# EAGLE design ecg_2017_nano (EAGLE 7.6.0)
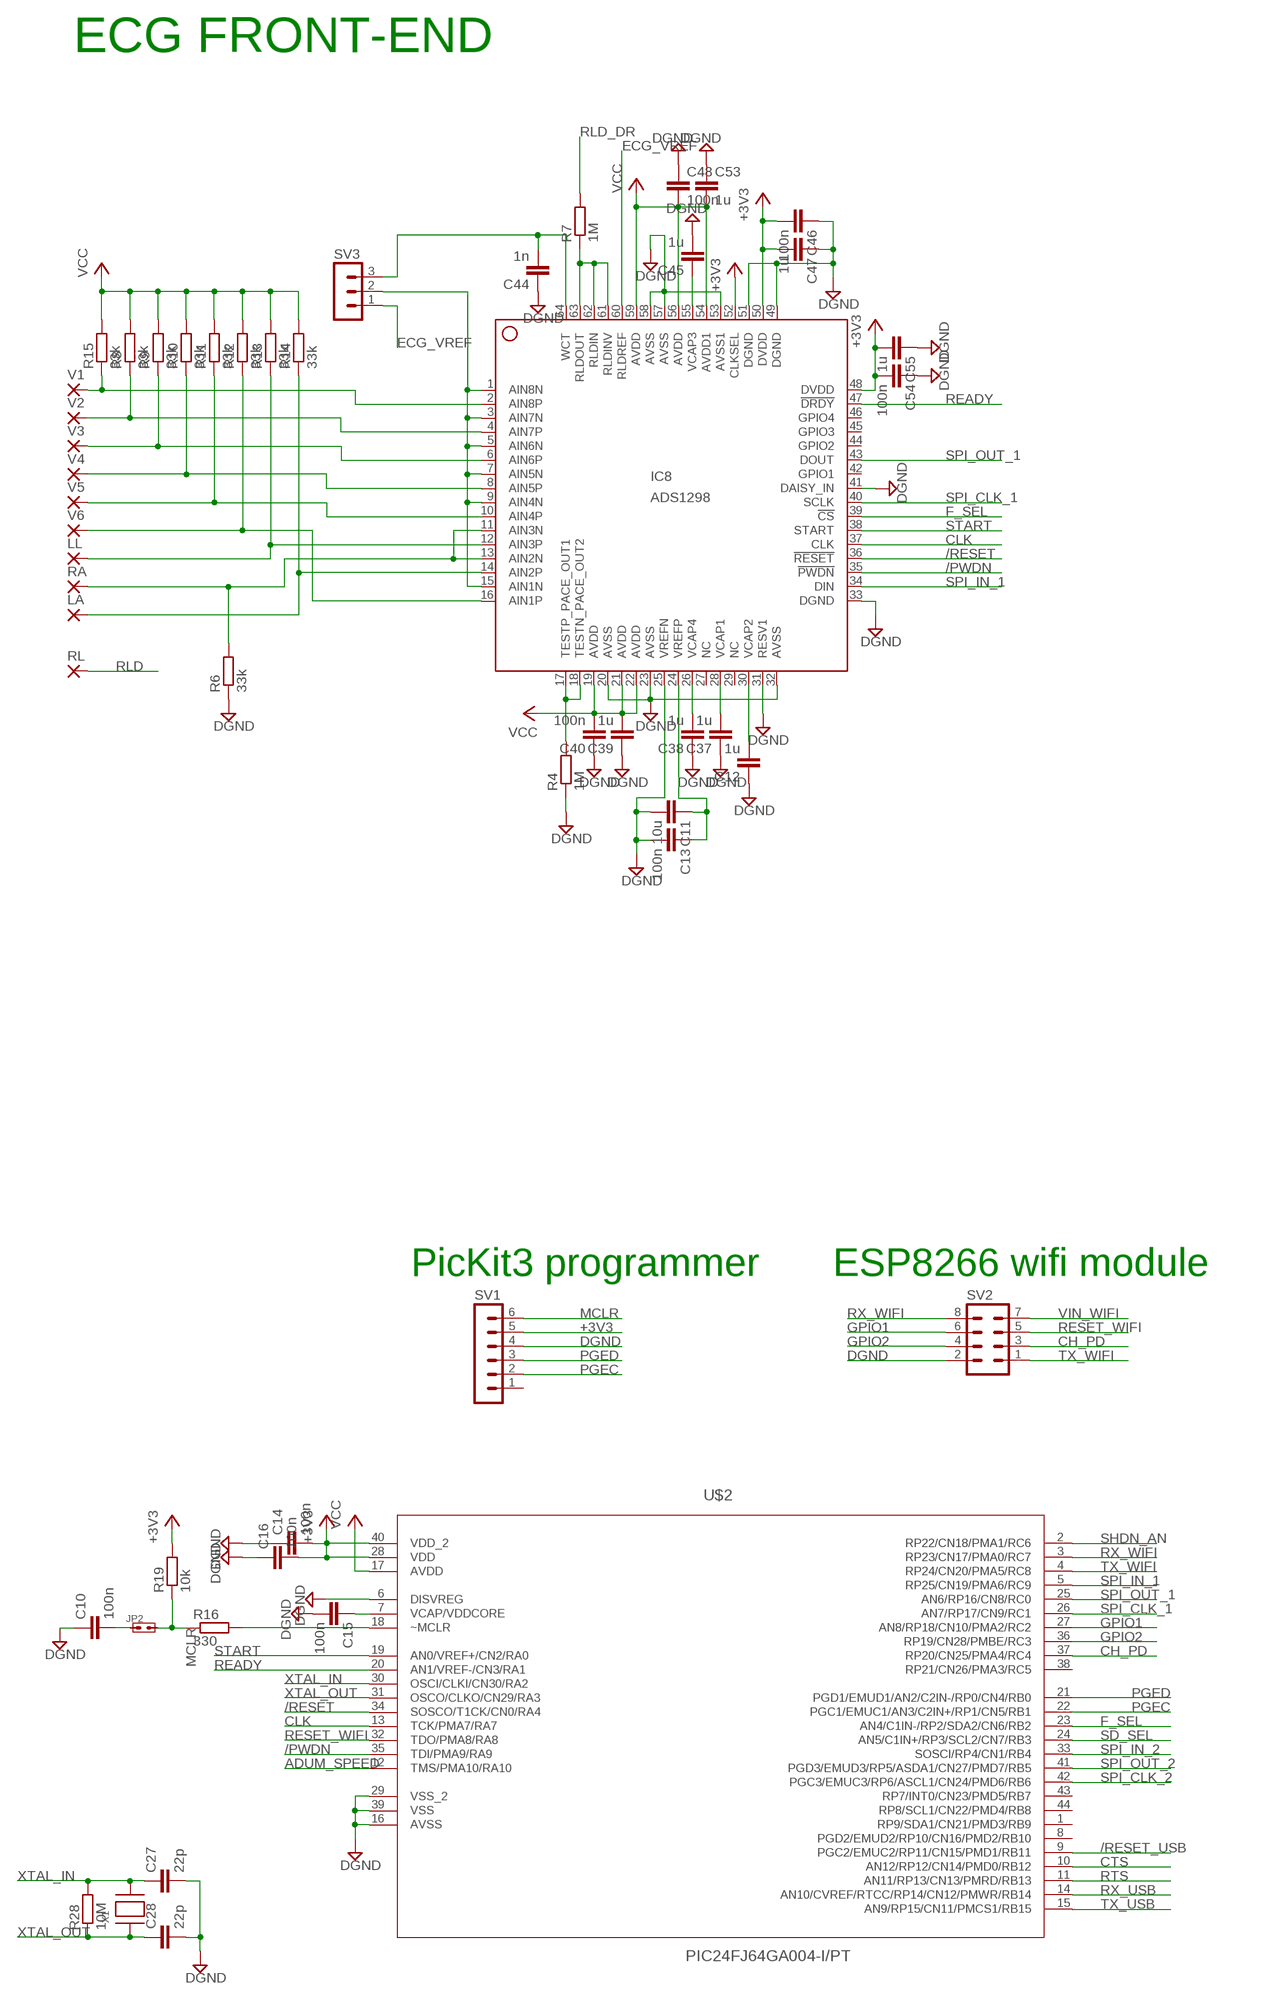
[diagram p0: schematic, sheet 1, part 1 of 2]
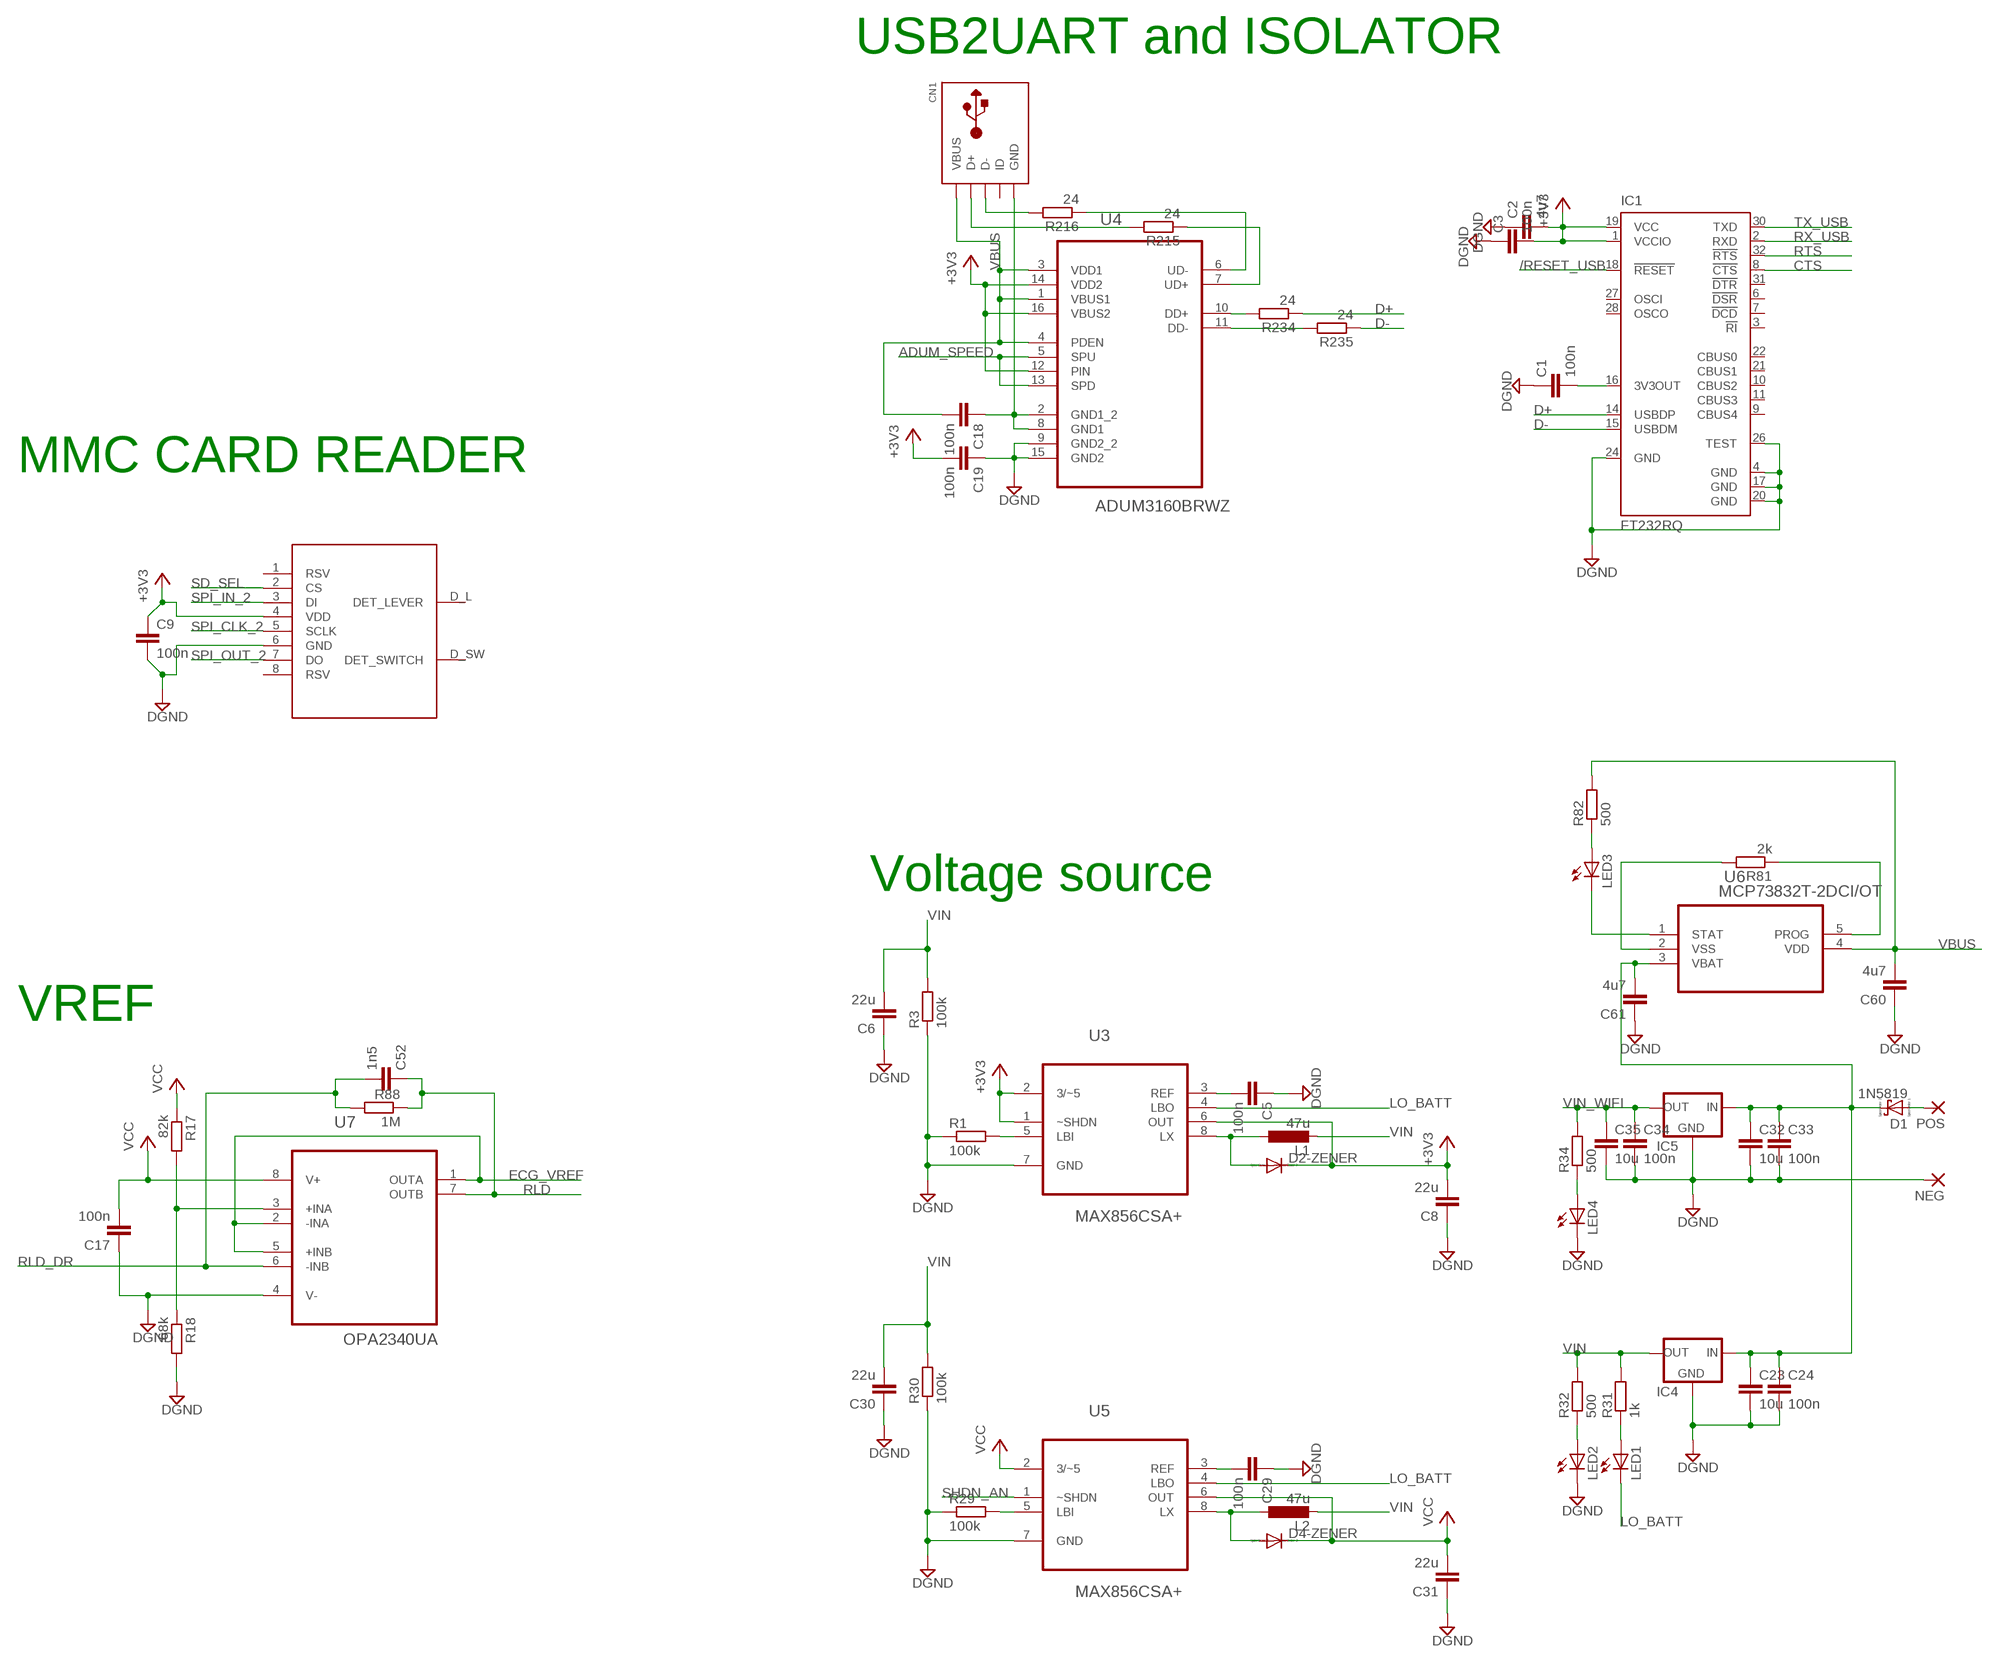
[diagram p1: schematic, sheet 1, part 2 of 2]

## Parts
C1  100n  C-EUC0603  [C0603]
C2  4u7  C-EUC0603  [C0603]
C3  100n  C-EUC0603  [C0603]
C5  100n  C-EUC0805  [C0805]
C6  22u  C-EUC0805  [C0805]
C8  22u  C-EUC0805  [C0805]
C9  100n  C-EUC0603  [C0603]
C10  100n  C-EUC0603  [C0603]
C11  10u  C-EUC0402  [C0402]
C12  1u  C-EUC0402  [C0402]
C13  100n  C-EUC0402  [C0402]
C14  100n  C-EUC0603  [C0603]
C15  100n  C-EUC0603  [C0603]
C16  100n  C-EUC0603  [C0603]
C17  100n  C-EUC0603  [C0603]
C18  100n  C-EUC0603  [C0603]
C19  100n  C-EUC0603  [C0603]
C23  10u  C-EUC0805  [C0805]
C24  100n  C-EUC0805  [C0805]
C27  22p  C-EUC0603  [C0603]
C28  22p  C-EUC0603  [C0603]
C29  100n  C-EUC0805  [C0805]
C30  22u  C-EUC0805  [C0805]
C31  22u  C-EUC0805  [C0805]
C32  10u  C-EUC0805  [C0805]
C33  100n  C-EUC0805  [C0805]
C34  100n  C-EUC0805  [C0805]
C35  10u  C-EUC0805  [C0805]
C37  1u  C-EUC0402  [C0402]
C38  1u  C-EUC0402  [C0402]
C39  1u  C-EUC0402  [C0402]
C40  100n  C-EUC0402  [C0402]
C44  1n  C-EUC0402  [C0402]
C45  1u  C-EUC0402  [C0402]
C46  100n  C-EUC0402  [C0402]
C47  1u  C-EUC0402  [C0402]
C48  100n  C-EUC0402  [C0402]
C52  1n5  C-EUC0603  [C0603]
C53  1u  C-EUC0402  [C0402]
C54  100n  C-EUC0402  [C0402]
C55  1u  C-EUC0402  [C0402]
C60  4u7  C-EUC0805  [C0805]
C61  4u7  C-EUC0805  [C0805]
CN1  USBMINIB  [USB-MINIB]
D1  1N5819  SCHOTTKY-DIODE  [DIODE_SMB]
D2-ZENER  DIODE-MICROMELF-R  [MICROMELF-R]
D4-ZENER  DIODE-MICROMELF-R  [MICROMELF-R]
IC1  FT232RQ  [QFN32]
IC4  R-783.3-0.5  [R-78XX]
IC5  R-783.3-0.5  [R-78XX]
IC8  ADS1298  [HTQFP-64-PAP]
JP2  JMP2  [JP2]
L1  47u  L-EUL2012C  [L2012C]
L2  47u  L-EUL2012C  [L2012C]
LA  2,54/1,0  [2,54/1,0]
LED1  LEDSML0805  [SML0805]
LED2  LEDSML0805  [SML0805]
LED3  LEDSML0805  [SML0805]
LED4  LEDSML0805  [SML0805]
LL  2,54/1,0  [2,54/1,0]
NEG  2,54/1,0  [2,54/1,0]
POS  2,54/1,0  [2,54/1,0]
R1  100k  R0805  [R0805]
R3  100k  R0805  [R0805]
R4  1M  R0603  [R0603]
R6  33k  R0603  [R0603]
R7  1M  R0603  [R0603]
R8  33k  R0603  [R0603]
R9  33k  R0603  [R0603]
R10  33k  R0603  [R0603]
R11  33k  R0603  [R0603]
R12  33k  R0603  [R0603]
R13  33k  R0603  [R0603]
R14  33k  R0603  [R0603]
R15  33k  R0603  [R0603]
R16  330  R0603  [R0603]
R17  82k  R0603  [R0603]
R18  68k  R0603  [R0603]
R19  10k  R0603  [R0603]
R28  10M  R-EU_R0603  [R0603]
R29  100k  R0805  [R0805]
R30  100k  R0805  [R0805]
R31  1k  R0805  [R0805]
R32  500  R0805  [R0805]
R34  500  R0805  [R0805]
R81  2k  R0805  [R0805]
R82  500  R0805  [R0805]
R88  1M  R0603  [R0603]
R215  24  R0603  [R0603]
R216  24  R0603  [R0603]
R234  24  R0603  [R0603]
R235  24  R0603  [R0603]
RA  2,54/1,0  [2,54/1,0]
RL  2,54/1,0  [2,54/1,0]
SV1  MA06-1  [MA06-1]
SV2  MA04-2  [MA04-2]
SV3  MA03-1  [MA03-1]
U3  MAX856CSA+  [SOIC127P600X175-8N]
U4  ADUM3160BRWZ  [SOIC127P1032X265-16N]
U5  MAX856CSA+  [SOIC127P600X175-8N]
U6  MCP73832T-2DCI/OT  [SOT95P300X145-5N]
U7  OPA2340UA  [SOIC127P600X175-8N]
U$1  MICROSDCARD_CONNECTOR  [MICROSDCARD_CONNECTOR]
U$2  PIC24FJ64GA004-I/PT  [QFP80P1200X1200X120-44N]
V1  2,54/1,0  [2,54/1,0]
V2  2,54/1,0  [2,54/1,0]
V3  2,54/1,0  [2,54/1,0]
V4  2,54/1,0  [2,54/1,0]
V5  2,54/1,0  [2,54/1,0]
V6  2,54/1,0  [2,54/1,0]
X1  XTAL-3.2X1.5  [XTAL3215]

## Nets
+3V3: C2.2 C3.2 C8.2 C9.1 C14.2 C16.2 C19.2 C46.2 C47.2 C54.2 C55.2 D2-ZENER.C IC1.1(VCCIO) IC1.19(VCC) IC8.48(DVDD) IC8.50(DVDD) IC8.52(CLKSEL) R19.2 SV1.5 U3.1(~SHDN) U3.2(3/~5) U3.6(OUT) U4.12(PIN) U4.14(VDD2) U4.16(VBUS2) U$1.4(VDD) U$2.28(VDD) U$2.40(VDD_2)
/PWDN: IC8.35(!PWDN) U$2.35(TDI/PMA9/RA9)
/RESET: IC8.36(!RESET) U$2.34(SOSCO/T1CK/CN0/RA4)
/RESET_USB: IC1.18(!RESET) U$2.9(PGC2/EMUC2/RP11/CN15/PMD1/RB11)
ADUM_SPEED: U4.5(SPU) U4.13(SPD) U$2.12(TMS/PMA10/RA10)
CH_PD: SV2.3 U$2.37(RP20/CN25/PMA4/RC4)
CLK: IC8.37(CLK) U$2.13(TCK/PMA7/RA7)
CTS: IC1.8(!CTS) U$2.10(AN12/RP12/CN14/PMD0/RB12)
D+: IC1.14(USBDP) R234.1
D-: IC1.15(USBDM) R235.1
DGND: C1.1 C2.1 C3.1 C5.1 C6.1 C8.1 C9.2 C10.1 C11.2 C12.1 C13.2 C14.1 C15.2 C16.1 C17.1 C19.1 C23.2 C24.2 C27.2 C28.2 C29.1 C30.1 C31.1 C32.2 C33.2 C34.2 C35.2 C37.1 C38.1 C39.1 C40.1 C44.1 C45.2 C46.1 C47.1 C48.1 C53.1 C54.1 C55.1 C60.1 C61.1 IC1.4(GND) IC1.17(GND) IC1.20(GND) IC1.24(GND) IC1.26(TEST) IC4.GND IC5.GND IC8.20(AVSS) IC8.23(AVSS) IC8.25(VREFN) IC8.31(RESV1) IC8.32(AVSS) IC8.33(DGND) IC8.41(DAISY_IN) IC8.49(DGND) IC8.51(DGND) IC8.53(AVSS1) IC8.57(AVSS) IC8.58(AVSS) LED2.C LED4.C NEG.1(P) R1.1 R3.1 R4.1 R6.1 R18.2 R29.1 R30.1 SV1.4 SV2.2 U3.7(GND) U4.9(GND2_2) U4.15(GND2) U5.7(GND) U7.4(V-) U$1.6(GND) U$2.6(DISVREG) U$2.16(AVSS) U$2.29(VSS_2) U$2.39(VSS)
ECG: IC8.1(AIN8N) IC8.3(AIN7N) IC8.5(AIN6N) IC8.7(AIN5N) IC8.9(AIN4N) IC8.15(AIN1N) SV3.2
ECG_VREF: IC8.60(RLDREF) SV3.1 U7.1(OUTA) U7.2(-INA) U7.5(+INB)
F_SEL: IC8.39(!CS) U$2.23(AN4/C1IN-/RP2/SDA2/CN6/RB2)
GPIO1: SV2.6 U$2.27(AN8/RP18/CN10/PMA2/RC2)
GPIO2: SV2.4 U$2.36(RP19/CN28/PMBE/RC3)
LO_BATT: LED1.C U3.4(LBO) U5.4(LBO)
MCLR: JP2.2 R16.1 R19.1 SV1.6
N$1: C5.2 U3.3(REF)
N$2: R1.2 U3.5(LBI)
N$3: IC8.17(TESTP_PACE_OUT1) IC8.18(TESTN_PACE_OUT2) R4.2
N$4: D2-ZENER.A L1.1 U3.8(LX)
N$5: IC8.14(AIN2P) LA.1(P) R14.1
N$6: IC8.16(AIN1P) R12.1 V6.1(P)
N$7: IC8.11(AIN3N) IC8.13(AIN2N) R6.2 RA.1(P)
N$8: C12.2 IC8.30(VCAP2)
N$9: IC8.12(AIN3P) LL.1(P) R13.1
N$10: C1.2 IC1.16(3V3OUT)
N$12: IC8.10(AIN4P) R11.1 V5.1(P)
N$13: D1.A(C) POS.1(P)
N$14: IC8.8(AIN5P) R10.1 V4.1(P)
N$15: C11.1 C13.1 IC8.24(VREFP)
N$16: IC8.6(AIN6P) R9.1 V3.1(P)
N$17: IC8.4(AIN7P) R8.1 V2.1(P)
N$18: R17.2 R18.1 U7.3(+INA)
N$19: IC8.2(AIN8P) R15.1 V1.1(P)
N$20: IC8.61(RLDINV) IC8.62(RLDIN) IC8.63(RLDOUT) R7.1
N$21: C10.2 JP2.1
N$22: C29.2 U5.3(REF)
N$23: R16.2 U$2.18(~MCLR)
N$24: C15.1 U$2.7(VCAP/VDDCORE)
N$25: C23.1 C24.1 C32.1 C33.1 C61.2 D1.C(A) IC4.IN IC5.IN U6.3(VBAT)
N$26: R81.1 U6.5(PROG)
N$27: R81.2 U6.2(VSS)
N$28: LED3.A R82.1
N$29: LED3.C U6.1(STAT)
N$32: C37.2 IC8.28(VCAP1)
N$33: C38.2 IC8.26(VCAP4)
N$38: R29.2 U5.5(LBI)
N$40: D4-ZENER.A L2.1 U5.8(LX)
N$41: LED1.A R31.1
N$42: LED2.A R32.1
N$44: C44.2 IC8.64(WCT) SV3.3
N$45: LED4.A R34.1
N$46: C45.1 IC8.55(VCAP3)
N$102: R216.1 U4.6(UD-)
N$103: R215.1 U4.7(UD+)
N$123: CN1.D- R216.2
N$124: R234.2 U4.10(DD+)
N$140: CN1.D+ R215.2
N$141: R235.2 U4.11(DD-)
PGEC: SV1.2 U$2.22(PGC1/EMUC1/AN3/C2IN+/RP1/CN5/RB1)
PGED: SV1.3 U$2.21(PGD1/EMUD1/AN2/C2IN-/RP0/CN4/RB0)
READY: IC8.47(!DRDY) U$2.20(AN1/VREF-/CN3/RA1)
RESET_WIFI: SV2.5 U$2.32(TDO/PMA8/RA8)
RLD: C52.1 R88.1 RL.1(P) U7.7(OUTB)
RLD_DR: C52.2 R7.2 R88.2 U7.6(-INB)
RTS: IC1.32(!RTS) U$2.11(AN11/RP13/CN13/PMRD/RB13)
RX_USB: IC1.2(RXD) U$2.14(AN10/CVREF/RTCC/RP14/CN12/PMWR/RB14)
RX_WIFI: SV2.8 U$2.3(RP23/CN17/PMA0/RC7)
SD_SEL: U$1.2(CS) U$2.24(AN5/C1IN+/RP3/SCL2/CN7/RB3)
SHDN_AN: U5.1(~SHDN) U$2.2(RP22/CN18/PMA1/RC6)
SPI_CLK_1: IC8.40(SCLK) U$2.26(AN7/RP17/CN9/RC1)
SPI_CLK_2: U$1.5(SCLK) U$2.42(PGC3/EMUC3/RP6/ASCL1/CN24/PMD6/RB6)
SPI_IN_1: IC8.34(DIN) U$2.5(RP25/CN19/PMA6/RC9)
SPI_IN_2: U$1.3(DI) U$2.33(SOSCI/RP4/CN1/RB4)
SPI_OUT_1: IC8.43(DOUT) U$2.25(AN6/RP16/CN8/RC0)
SPI_OUT_2: U$1.7(DO) U$2.41(PGD3/EMUD3/RP5/ASDA1/CN27/PMD7/RB5)
START: IC8.38(START) U$2.19(AN0/VREF+/CN2/RA0)
TX_USB: IC1.30(TXD) U$2.15(AN9/RP15/CN11/PMCS1/RB15)
TX_WIFI: SV2.1 U$2.4(RP24/CN20/PMA5/RC8)
USB_GND: C18.1 CN1.GND U4.2(GND1_2) U4.8(GND1)
VBUS: C18.2 C60.2 CN1.VBUS R82.2 U4.1(VBUS1) U4.3(VDD1) U4.4(PDEN) U6.4(VDD)
VCC: C17.2 C31.2 C39.2 C40.2 C48.2 C53.2 D4-ZENER.C IC8.19(AVDD) IC8.21(AVDD) IC8.22(AVDD) IC8.54(AVDD1) IC8.56(AVDD) IC8.59(AVDD) R8.2 R9.2 R10.2 R11.2 R12.2 R13.2 R14.2 R15.2 R17.1 U5.2(3/~5) U5.6(OUT) U7.8(V+) U$2.17(AVDD)
VIN: C6.2 C30.2 IC4.OUT L1.2 L2.2 R3.2 R30.2 R31.2 R32.2
VIN_WIFI: C34.1 C35.1 IC5.OUT R34.2 SV2.7
XTAL_IN: C27.1 R28.2 U$2.30(OSCI/CLKI/CN30/RA2) X1.P$2
XTAL_OUT: C28.1 R28.1 U$2.31(OSCO/CLKO/CN29/RA3) X1.P$1
Unconnected: CN1.ID IC1.3(!RI) IC1.6(!DSR) IC1.7(!DCD) IC1.9(CBUS4) IC1.10(CBUS2) IC1.11(CBUS3) IC1.21(CBUS1) IC1.22(CBUS0) IC1.27(OSCI) IC1.28(OSCO) IC1.31(!DTR) IC8.27(NC) IC8.29(NC) IC8.42(GPIO1) IC8.44(GPIO2) IC8.45(GPIO3) IC8.46(GPIO4) SV1.1 U$1.1(RSV) U$1.8(RSV) U$1.D_L(DET_LEVER) U$1.D_SW(DET_SWITCH) U$2.1(RP9/SDA1/CN21/PMD3/RB9) U$2.8(PGD2/EMUD2/RP10/CN16/PMD2/RB10) U$2.38(RP21/CN26/PMA3/RC5) U$2.43(RP7/INT0/CN23/PMD5/RB7) U$2.44(RP8/SCL1/CN22/PMD4/RB8)

## Notes on the sheet
- ECG FRONT-END
- USB2UART and ISOLATOR
- MMC CARD READER
- Voltage source
- VREF
- PicKit3 programmer | ESP8266 wifi module

## Library data of the parts
C1-C3 C5 C6 C8-C19 C23 C24 C27-C35 C37-C40 C44-C48 C52-C55 C60 C61 = resistor:C-EU: CAPACITOR, European symbol
CN1 = adafruit:USB: USB Connectors USBMINIB - Surface Mount Female Mini-B USB Connector 4UConnector: 06564 By microbuilder.eu Thru-hole RA Female Mini-B USB Connector 4UConnector: 18732 By ladyada.net
D1 = eagle-ltspice:SCHOTTKY-DIODE: Schottky Diode; SPICEMODEL: NONE; SPICEPREFIX: D; SPICETYPE: diode
D2-ZENER D4-ZENER = diode:DIODE-: DIODE
IC1 = ftdichip:FT232R: Source: http://www.ftdichip.com/Documents/DataSheets/DS_FT232R_v104.pdf; MPN: FT232RQ; OC_FARNELL: 1146033; OC_NEWARK: 91K9919
IC4 IC5 = Zoli2:R-78*: VOLTAGE REGULATOR
IC8 = fabhack:ADS1298: Quad/Octal, Simultaneous Sampling, 24-Bit Analog-to-Digital Converters ADS1294 / ADS1298 Source: http://focus.ti.com/lit/ds/symlink/ads1294.pdf; MPN: ADS1294IPAG
JP2 = Zoli:JMP2
L1 L2 = resistor:L-EU: INDUCTOR, European symbol
LA LL NEG POS RA RL V1-V6 = wirepad:2,54/1,0: THROUGH-HOLE PAD
LED1-LED4 = led:LED: LED OSRAM: - CHIPLED LG R971, LG N971, LY N971, LG Q971, LY Q971, LO R971, LY R971 LH N974, LH R974 LS Q976, LO Q976, LY Q976 LO Q996 - Hyper CHIPLED LW Q18S LB Q993, LB Q99A, LB R99A - SideLED LS A670, LO A670, LY A670, LG A670, LP A670 LB A673, LV A673, LT A673, LW A673 LH A674 LY A675 LS A676, LA A676, LO A676, LY A676, LW A676 LS A679, LY A679, LG A679 - Hyper Micro SIDELED® LS Y876, LA Y876, LO Y876, LY Y876 LT Y87S - SmartLED LW L88C, LW L88S LB L89C, LB L89S, LG L890 LS L89K, LO L89K, LY L89K LS L896, LA L896, LO L896, LY L896 - TOPLED LS T670, LO T670, LY T670, LG T670, LP T670 LSG T670, LSP T670, LSY T670, LOP T670, LYG T670 LG T671, LOG T671, LSG T671 LB T673, LV T673, LT T673, LW T673 LH T674 LS T676, LA T676, LO T676, LY T676, LB T676, LH T676, LSB T676, LW T676 LB T67C, LV T67C, LT T67C, LS T67K, LO T67K, LY T67K, LW E67C LS E67B, LA E67B, LO E67B, LY E67B, LB E67C, LV E67C, LT E67C LW T67C LS T679, LY T679, LG T679 LS T770, LO T770, LY T770, LG T770, LP T770 LB T773, LV T773, LT T773, LW T773 LH T774 LS E675, LA E675, LY E675, LS T675 LS T776, LA T776, LO T776, LY T776, LB T776 LHGB T686 LT T68C, LB T68C - Hyper Mini TOPLED® LB M676 - Mini TOPLED Santana® LG M470 LS M47K, LO M47K, LY M47K Source: http://www.osram.convergy.de LUXEON: - LUMILED® LXK2-PW12-R00, LXK2-PW12-S00, LXK2-PW14-U00, LXK2-PW14-V00 LXK2-PM12-R00, LXK2-PM12-S00, LXK2-PM14-U00 LXK2-PE12-Q00, LXK2-PE12-R00, LXK2-PE12-S00, LXK2-PE14-T00, LXK2-PE14-U00 LXK2-PB12-K00, LXK2-PB12-L00, LXK2-PB12-M00, LXK2-PB14-N00, LXK2-PB14-P00, LXK2-PB14-Q00 LXK2-PR12-L00, LXK2-PR12-M00, LXK2-PR14-Q00, LXK2-PR14-R00 LXK2-PD12-Q00, LXK2-PD12-R00, LXK2-PD12-S00 LXK2-PH12-R00, LXK2-PH12-S00 LXK2-PL12-P00, LXK2-PL12-Q00, LXK2-PL12-R00 Source: www.luxeon.com KINGBRIGHT: KA-3528ASYC Source: www.kingbright.com
R1 R3 R4 R6-R19 R29-R32 R34 R81 R82 R88 R215 R216 R234 R235 = Zoli:R: Resistor
R28 = resistor:R-EU_: RESISTOR, European symbol
SV1 = con-lstb:MA06-1: PIN HEADER; OC_FARNELL: unknown; OC_NEWARK: unknown
SV2 = con-lstb:MA04-2: PIN HEADER; OC_FARNELL: unknown; OC_NEWARK: unknown
SV3 = con-lstb:MA03-1: PIN HEADER; OC_FARNELL: unknown; OC_NEWARK: unknown
U3 U5 = Maxim_By_element14_Batch_1:MAX856CSA+: Step-Up DC-DC Converters; MPN: MAX856CSA+; OC_FARNELL: 9725040; OC_NEWARK: 67K6793; PACKAGE: SOIC-8; SUPPLIER: Maxim
U4 = Analog Devices_By_element14_Batch_1:ADUM3160BRWZ: Full/Low Speed 2.5 kV USB Digital Isolator; MPN: ADUM3160BRWZ; OC_FARNELL: 1843660; OC_NEWARK: 85R6420; PACKAGE: SOIC-16; SUPPLIER: Analog Devices
U6 = Microchip_By_element14_Batch_1:MCP73832T-2DCI/OT: IC, BATT CHARGER, Li-Ion Li-Polymer, 500 mA; MPN: MCP73832T-2DCI/OT; OC_FARNELL: 1834892; OC_NEWARK: 84R5198; PACKAGE: SOT23-5; SUPPLIER: Microchip
U7 = Texas Instruments_By_element14_Batch_1:OPA2340UA: SINGLE-SUPPLY, RAIL-TO-RAIL OPERATIONAL AMPLIFIERS; MPN: OPA2340UA; OC_FARNELL: 1101541; OC_NEWARK: 36K7581; PACKAGE: SOIC-8; SUPPLIER: Texas Instruments
U$1 = Zoli2:MICROSDCARD_CONNECTOR
U$2 = Microchip_By_element14_Batch_1:PIC24FJ64GA004-I/PT: 16-Bit Flash Microcontrollers; DESCRIPTION: 16-Bit Flash Microcontrollers; MPN: PIC24FJ64GA004-I/PT; OC_FARNELL: 1332299; OC_NEWARK: 88K6136; PACKAGE: TQFP-44; SUPPLIER: Microchip
X1 = adafruit:XTAL: Low cost SMT crystals, no capacitors included http://www.ladyada.net/library/eagle

## Board
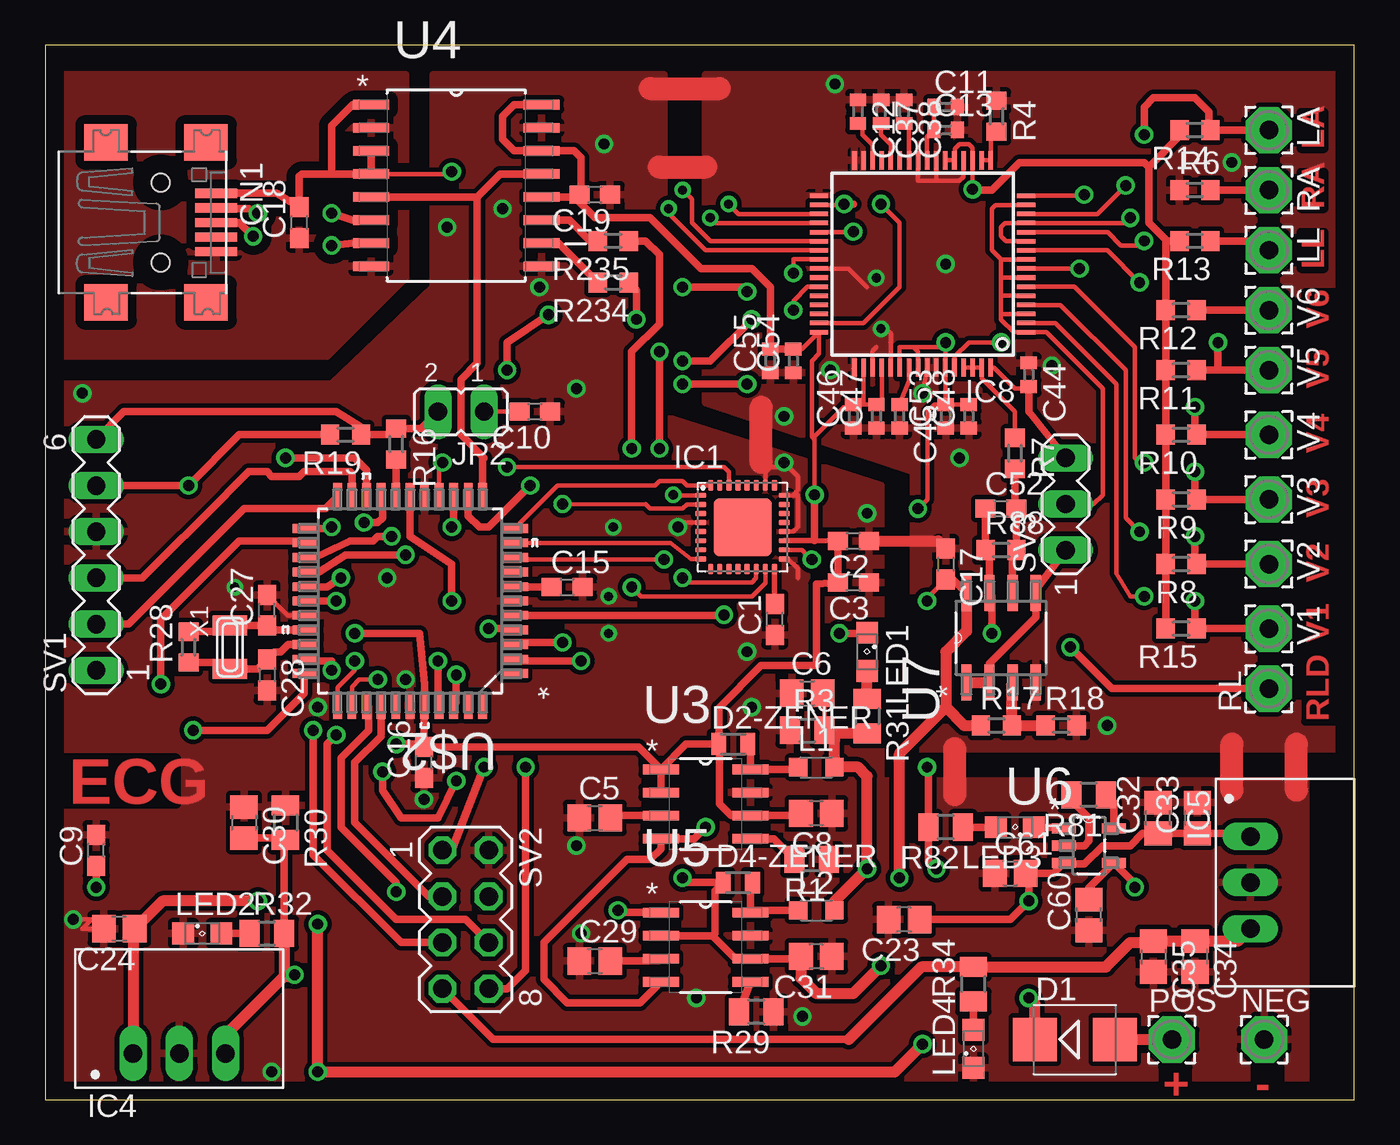
[diagram p2: board, top side]
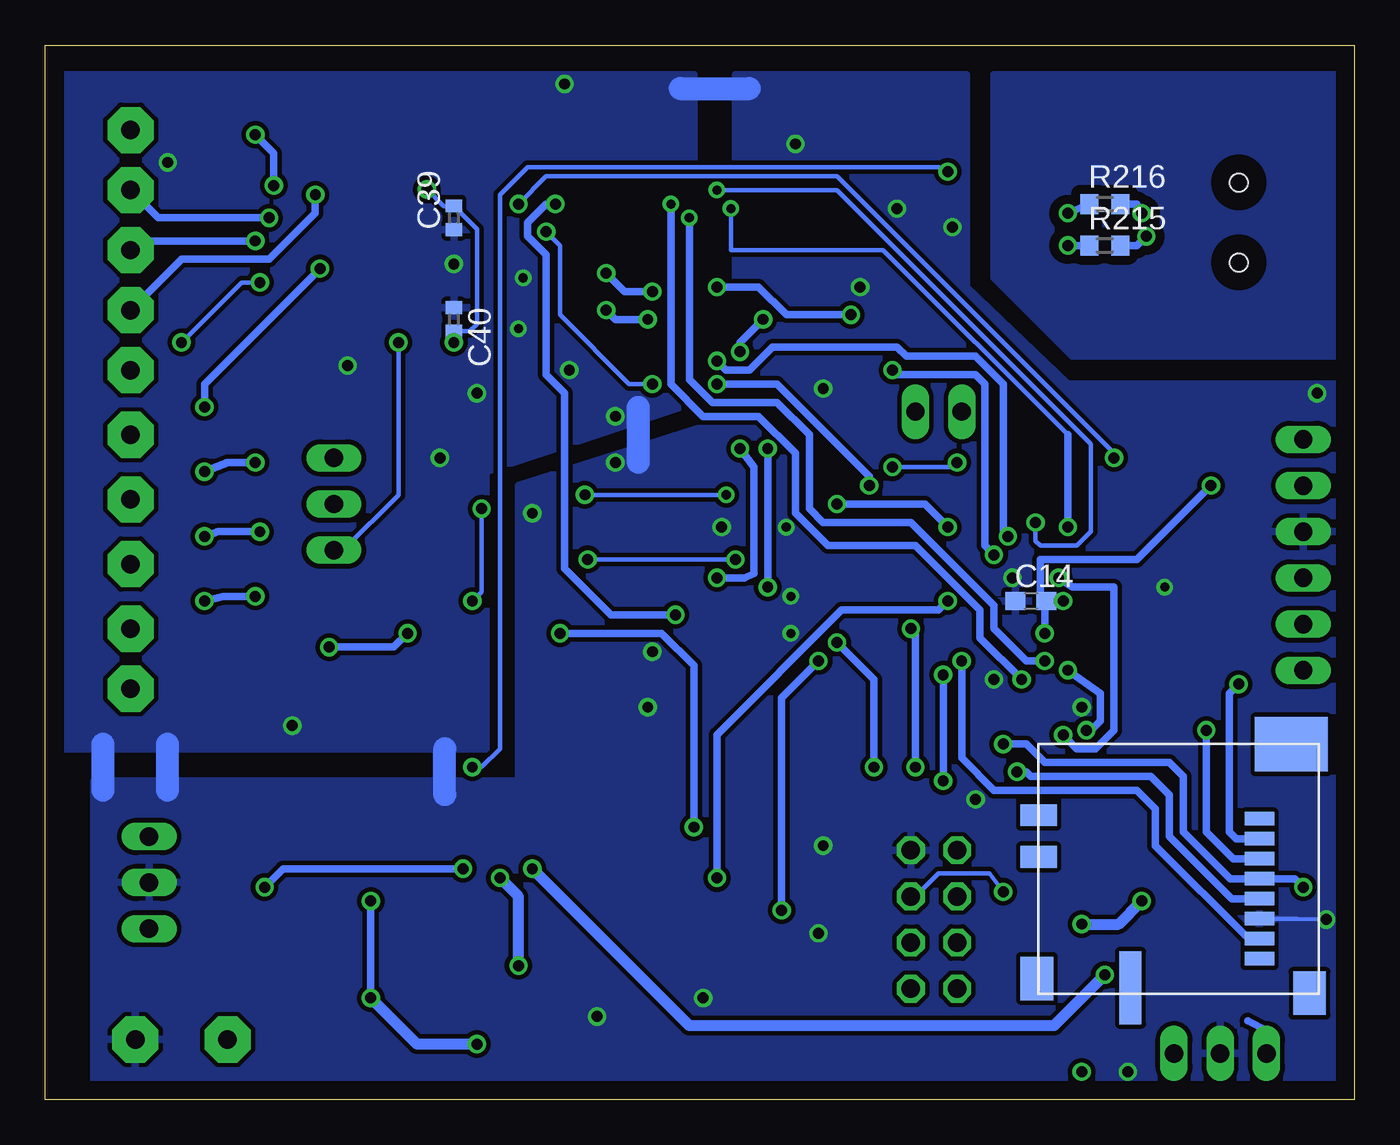
[diagram p3: board, bottom side, seen from below]

Size 72 x 58 mm. Coordinates in mm from the lower left corner, seen from the top.
Outline: 0,0 72,0 72,58 0,58 0,0
Copper layers (1*16): Top 0.035mm / dielectric 1.5mm / Bottom 0.035mm
Design rules "default *": minimum track width 8mil, minimum drill 18mil, track to track 6mil, track to pad 6mil, pad to pad 6mil, via to via 6mil, smd to smd 0mil, copper to edge 40mil, drill to drill 8mil, minimum pad ring 10mil, minimum via ring 8mil, stop-mask expansion 4mil, vias tented up to drill 0mil, thermal gap 10mil

### Footprints (pad centres in the part's own frame; a part is rotated, then mirrored left to right if it is on the bottom)
C0603 = smd 1.1 x 1: 1 -0.85,0; 2 0.85,0
C0805 = smd 1.3 x 1.5: 1 -0.85,0; 2 0.85,0
C0402 = smd 0.7 x 0.9: 1 -0.65,0; 2 0.65,0
USB-MINIB = smd 0.5 x 2.308: D+ 0,4.064; D- -0.8,4.064; GND 1.6,4.064; ID 0.8,4.064; VBUS -1.6,4.064 | smd 2 x 2.4: GND1 -4.4,-2; GND2 -4.4,3.5; GND3 4.4,3.5; GND4 4.4,-2 | hole 1: -2.2,1; 2.2,1
DIODE_SMB = smd 2.4 x 2.4: A 2.2,0; C -2.2,0
MICROMELF-R = smd 0.8 x 1.2: A 0.8,0; C -0.8,0
QFN32 = smd 0.6 x 0.3: 1 -2.3,1.75; 2 -2.3,1.25; 3 -2.3,0.75; 4 -2.3,0.25; 5 -2.3,-0.25; 6 -2.3,-0.75; 7 -2.3,-1.25; 8 -2.3,-1.75; 17 2.3,-1.75; 18 2.3,-1.25; 19 2.3,-0.75; 20 2.3,-0.25; 21 2.3,0.25; 22 2.3,0.75; 23 2.3,1.25; 24 2.3,1.75 | smd 0.3 x 0.6: 9 -1.75,-2.3; 10 -1.25,-2.3; 11 -0.75,-2.3; 12 -0.25,-2.3; 13 0.25,-2.3; 14 0.75,-2.3; 15 1.25,-2.3; 16 1.75,-2.3; 25 1.75,2.3; 26 1.25,2.3; 27 0.75,2.3; 28 0.25,2.3; 29 -0.25,2.3; 30 -0.75,2.3; 31 -1.25,2.3; 32 -1.75,2.3 | smd 3.2 x 3.2: EXP 0,0
R-78XX = drill 1.016 long: GND 0,-2.54; IN -2.54,-2.54; OUT 2.54,-2.54
HTQFP-64-PAP = smd 1 x 0.25: 1 -5.7,3.75; 2 -5.7,3.25; 3 -5.7,2.75; 4 -5.7,2.25; 5 -5.7,1.75; 6 -5.7,1.25; 7 -5.7,0.75; 8 -5.7,0.25; 9 -5.7,-0.25; 10 -5.7,-0.75; 11 -5.7,-1.25; 12 -5.7,-1.75; 13 -5.7,-2.25; 14 -5.7,-2.75; 15 -5.7,-3.25; 16 -5.7,-3.75; 33 5.7,-3.75; 34 5.7,-3.25; 35 5.7,-2.75; 36 5.7,-2.25; 37 5.7,-1.75; 38 5.7,-1.25; 39 5.7,-0.75; 40 5.7,-0.25; 41 5.7,0.25; 42 5.7,0.75; 43 5.7,1.25; 44 5.7,1.75; 45 5.7,2.25; 46 5.7,2.75; 47 5.7,3.25; 48 5.7,3.75 | smd 0.25 x 1: 17 -3.75,-5.7; 18 -3.25,-5.7; 19 -2.75,-5.7; 20 -2.25,-5.7; 21 -1.75,-5.7; 22 -1.25,-5.7; 23 -0.75,-5.7; 24 -0.25,-5.7; 25 0.25,-5.7; 26 0.75,-5.7; 27 1.25,-5.7; 28 1.75,-5.7; 29 2.25,-5.7; 30 2.75,-5.7; 31 3.25,-5.7; 32 3.75,-5.7; 49 3.75,5.7; 50 3.25,5.7; 51 2.75,5.7; 52 2.25,5.7; 53 1.75,5.7; 54 1.25,5.7; 55 0.75,5.7; 56 0.25,5.7; 57 -0.25,5.7; 58 -0.75,5.7; 59 -1.25,5.7; 60 -1.75,5.7; 61 -2.25,5.7; 62 -2.75,5.7; 63 -3.25,5.7; 64 -3.75,5.7
JP2 = drill 1 long: 1 -1.27,0; 2 1.27,0
L2012C = smd 1 x 1: 1 -1,0; 2 1,0
2,54/1,0 = drill 1.016 pad 2.54 octagon: 1 0,0
SML0805 = smd 1.2 x 1.2: A 1.05,0; C -1.05,0
R0805 = smd 1.1 x 1.5: 1 -0.95,0; 2 0.95,0
R0603 = smd 1 x 1.1: 1 -0.85,0; 2 0.85,0
MA06-1 = drill 1.016 long: 1 -6.35,0; 2 -3.81,0; 3 -1.27,0; 4 1.27,0; 5 3.81,0; 6 6.35,0
MA04-2 = drill 1.016 octagon: 1 -3.81,-1.27; 2 -3.81,1.27; 3 -1.27,-1.27; 4 -1.27,1.27; 5 1.27,-1.27; 6 1.27,1.27; 7 3.81,-1.27; 8 3.81,1.27
MA03-1 = drill 1.016 long: 1 -2.54,0; 2 0,0; 3 2.54,0
SOIC127P600X175-8N = smd 1.981 x 0.533: 1 -2.464,1.905; 2 -2.464,0.635; 3 -2.464,-0.635; 4 -2.464,-1.905; 5 2.464,-1.905; 6 2.464,-0.635; 7 2.464,0.635; 8 2.464,1.905
SOIC127P1032X265-16N = smd 1.981 x 0.533: 1 -4.699,4.445; 2 -4.699,3.175; 3 -4.699,1.905; 4 -4.699,0.635; 5 -4.699,-0.635; 6 -4.699,-1.905; 7 -4.699,-3.175; 8 -4.699,-4.445; 9 4.699,-4.445; 10 4.699,-3.175; 11 4.699,-1.905; 12 4.699,-0.635; 13 4.699,0.635; 14 4.699,1.905; 15 4.699,3.175; 16 4.699,4.445
SOT95P300X145-5N = smd 1.321 x 0.559: 1 -1.372,0.94; 2 -1.372,0; 3 -1.372,-0.94; 4 1.372,-0.94; 5 1.372,0.94
SOIC127P600X175-8N' = smd 1.981 x 0.559: 1 -2.464,1.905; 2 -2.464,0.635; 3 -2.464,-0.635; 4 -2.464,-1.905; 5 2.464,-1.905; 6 2.464,-0.635; 7 2.464,0.635; 8 2.464,1.905
MICROSDCARD_CONNECTOR = smd 0.75 x 1.6: 1 -2.75,4.45; 2 -1.65,4.45; 3 -0.55,4.45; 4 0.55,4.45; 5 1.65,4.45; 6 2.75,4.45; 7 3.85,4.45; 8 4.95,4.45 | smd 4 x 1.2: D_L 6.55,-2.65 | smd 1.2 x 2: D_SW -0.65,-7.7; P$4 -2.95,-7.7 | smd 3 x 4: P$1 -6.85,6.2 | smd 2.4 x 1.8: P$2 6.85,7.2; P$3 6.04,-7.8
QFP80P1200X1200X120-44N = smd 1.473 x 0.483: 1 -5.74,3.988; 2 -5.74,3.2; 3 -5.74,2.388; 4 -5.74,1.6; 5 -5.74,0.787; 6 -5.74,0; 7 -5.74,-0.787; 8 -5.74,-1.6; 9 -5.74,-2.388; 10 -5.74,-3.2; 11 -5.74,-3.988; 23 5.74,-3.988; 24 5.74,-3.2; 25 5.74,-2.388; 26 5.74,-1.6; 27 5.74,-0.787; 28 5.74,0; 29 5.74,0.787; 30 5.74,1.6; 31 5.74,2.388; 32 5.74,3.2; 33 5.74,3.988 | smd 0.483 x 1.473: 12 -3.988,-5.74; 13 -3.2,-5.74; 14 -2.388,-5.74; 15 -1.6,-5.74; 16 -0.787,-5.74; 17 0,-5.74; 18 0.787,-5.74; 19 1.6,-5.74; 20 2.388,-5.74; 21 3.2,-5.74; 22 3.988,-5.74; 34 3.988,5.74; 35 3.2,5.74; 36 2.388,5.74; 37 1.6,5.74; 38 0.787,5.74; 39 0,5.74; 40 -0.787,5.74; 41 -1.6,5.74; 42 -2.388,5.74; 43 -3.2,5.74; 44 -3.988,5.74
XTAL3215 = smd 1.1 x 1.9: P$1 1.2,0; P$2 -1.2,0

### Placement (x,y rotation side)
C1  40.13,26.42 90 top
C2  44.45,30.73 180 top
C3  44.45,28.45 180 top
C5  30.23,15.49 0 top
C6  41.91,22.35 0 top
C8  42.42,15.75 180 top
C9  2.79,13.72 90 top
C10  26.92,37.85 180 top
C11  49.53,54.61 0 top
C12  44.7,54.36 270 top
C13  49.53,53.34 0 top
C14  17.78,27.43 0 bottom
C15  28.7,28.19 0 top
C16  20.83,18.54 90 top
C17  49.53,29.46 270 top
C18  13.97,48.26 90 top
C19  30.23,49.78 180 top
C23  47.24,9.91 180 top
C24  4.06,9.4 180 top
C27  12.19,26.92 90 top
C28  12.19,23.37 270 top
C29  30.23,7.62 0 top
C30  10.92,15.24 270 top
C31  42.42,7.87 180 top
C32  61.21,15.49 90 top
C33  63.37,15.49 90 top
C34  63.25,7.87 270 top
C35  60.96,7.87 270 top
C37  45.97,54.36 270 top
C38  47.24,54.36 270 top
C39  49.53,48.51 90 bottom
C40  49.53,42.93 270 bottom
C44  54.1,39.88 270 top
C45  46.99,37.59 270 top
C46  44.45,37.59 90 top
C47  45.72,37.59 90 top
C48  50.8,37.59 90 top
C52  52.58,32.51 0 top
C53  49.53,37.59 90 top
C54  41.15,40.64 90 top
C55  39.88,40.64 90 top
C60  57.4,10.16 90 top
C61  53.09,12.45 0 top
CN1  5.33,48.26 270 top
D1  56.64,3.3 0 top
D2-ZENER  37.85,19.56 0 top
D4-ZENER  38.1,11.94 0 top
IC1  38.35,31.5 0 top
IC4  7.37,5.08 0 top
IC5  68.83,11.94 270 top
IC8  48.26,45.97 180 top
JP2  22.86,37.85 180 top
L1  42.42,18.29 0 top
L2  42.42,10.41 0 top
LA  67.31,53.34 270 top
LED1  45.21,24.64 270 top
LED2  8.64,9.14 0 top
LED3  53.34,14.99 180 top
LED4  51.05,2.79 90 top
LL  67.31,46.74 270 top
NEG  67.06,3.3 0 top
POS  61.98,3.3 0 top
R1  42.16,13.21 180 top
R3  41.91,20.32 0 top
R4  52.32,54.1 270 top
R6  63.25,50.04 0 top
R7  53.34,35.56 270 top
R8  62.48,29.46 180 top
R9  62.48,33.02 180 top
R10  62.48,36.58 180 top
R11  62.48,40.13 180 top
R12  62.48,43.43 180 top
R13  63.25,47.24 180 top
R14  63.25,53.34 180 top
R15  62.48,25.91 180 top
R16  19.3,36.07 270 top
R17  52.32,20.57 0 top
R18  55.88,20.57 0 top
R19  16.51,36.58 180 top
R28  7.87,24.89 90 top
R29  39.12,4.83 180 top
R30  13.21,15.24 270 top
R31  45.21,21.08 270 top
R32  12.19,9.14 0 top
R34  51.05,6.35 90 top
R81  57.4,16.76 180 top
R82  49.53,14.99 180 top
R88  52.58,30.23 0 top
R215  13.72,46.99 0 bottom
R216  13.72,49.28 0 bottom
R234  31.24,44.96 180 top
R235  31.24,47.24 180 top
RA  67.31,50.04 270 top
RL  67.31,22.61 90 top
SV1  2.79,29.97 90 top
SV2  23.11,9.91 270 top
SV3  56.13,32.77 90 top
U3  36.32,16.26 0 top
U4  22.61,50.29 0 top
U5  36.32,8.38 0 top
U6  57.4,13.97 0 top
U7  OPA2340UA  [SOIC127P600X175-8N']  52.58,25.4 90 top
U$1  9.65,12.7 270 bottom
U$2  20.07,27.43 180 top
V1  67.31,25.91 270 top
V2  67.31,29.46 270 top
V3  67.31,33.02 270 top
V4  67.31,36.58 270 top
V5  67.31,40.13 270 top
V6  67.31,43.43 270 top
X1  10.16,24.89 270 top

### Tracks (layer width: path | path; a pad name or v marks a point on that pad's centre or on a via)
+3V3  (via drill 0.5, 0.6)
  Top 0.254: C19.2 29.38,49.36 | C54.2 41.63,41.29 IC8.48 42.56,41.04 42.16,40.64 42.16,36.48 42.32,36.32 | 44.96,38.24 C46.2 44.56,38.1 43.94,38.1 42.32,36.48 42.32,36.32 | 44.96,38.24 C47.2 46.01,38.53 IC8.52 | 42.32,33.43 42.32,36.32 | 20.49,19.56 C16.2 | IC1.1 34.57,33.25 v34.54,33.27 | 44.96,38.24 45.01,38.29 IC8.50
  Top 0.305: IC1.19 42.32,30.75 C2.2
  Top 0.406: U4.12 29.25,49.66 C19.2 29.46,49.87 29.46,51.82 29.08,52.2 U4.14 25.78,52.2 25.15,52.83 25.15,54.1 25.78,54.74 U4.16 | D2-ZENER.C 35.26,19.56 U3.1 | U3.1 U3.2 | C8.2 41.44,15.62 U3.6 37.72,15.62 37.08,16.26 37.08,19.52 D2-ZENER.C | v2.79,11.68 C9.1 | SV1.5 v7.87,33.78 10.67,36.58 R19.2 | U$2.28 v16,27.43 | D2-ZENER.C 37.05,21.55 39.37,23.88 42.42,23.88 42.42,28.36 C3.2 C2.2 | 42.32,30.75 v42.32,33.27 42.32,33.43 | U3.1 32.63,19.39 C16.2 20.83,21.67 U$2.40 20.85,22.84 20.57,25.65 v17.02,25.65 | 29.38,49.36 30.23,48.51 33.27,48.51 36.07,45.72 38.86,45.72 39.88,44.7 C55.2 C54.2 | v19.3,19.56 20.49,19.56
  Bottom 0.254: 17.27,27.6 C14.2 17.02,27.34 | v34.54,33.27 v42.32,33.27
  Bottom 0.406: v2.79,11.68 3.26,12.15 U$1.4 6.82,12.15 9.4,14.73 9.4,17.78 10.16,18.54 17.02,18.54 18.03,19.56 v19.3,19.56 | 17.27,27.6 17.27,29.72 11.94,29.72 v7.87,33.78 | v16,27.43 C14.2 | v17.02,25.65 17.02,27.34
/PWDN  (via drill 0.5, 0.6)
  Top 0.254: U$2.35 16.87,22.71 17.27,23.11 v18.29,23.11 | IC8.35 38.14,48.72 v37.59,49.28
  Bottom 0.406: v18.29,23.11 20.57,25.4 20.57,26.92 24.13,30.48 28.96,30.48 30.73,32.26 30.73,35.56 32.77,37.59 35.81,37.59 37.59,39.37 v37.59,49.28
/RESET  (via drill 0.5, 0.6)
  Top 0.254: U$2.34 16.08,22.68 17.02,23.62 v17.02,24.13 | IC8.36 36.61,48.22 v36.58,48.51
  Bottom 0.406: v17.02,24.13 18.03,24.13 19.81,25.91 19.81,27.18 24.38,31.75 29.21,31.75 29.97,32.51 29.97,36.58 31.75,38.35 35.31,38.35 36.58,39.62 v36.58,48.51
/RESET_USB  (via drill 0.6)
  Top 0.254: IC1.18 41.64,30.25 v42.16,29.72 | v34.04,29.72 25.91,29.72 U$2.9
  Bottom 0.254: v42.16,29.72 v34.04,29.72
ADUM_SPEED
  Top 0.406: U4.5 23.75,49.66 | 23.75,49.66 25.02,50.93 U4.13 | 23.75,49.66 23.75,40.51 22.86,39.62 22.86,36.58 24.13,35.31 24.05,35.23 U$2.12
CH_PD
  Top 0.406: SV2.3 21.08,11.18 17.02,15.24 17.02,18.54 18.47,19.99 U$2.37
CLK  (via drill 0.6)
  Top 0.254: v44.45,47.75 43.94,47.75 43.91,47.72 IC8.37
  Top 0.406: U$2.13 23.27,32.11 23.88,31.5 24.38,31.5 v26.67,33.78 | v35.05,39.37 v38.61,39.37
  Bottom 0.254: v38.61,39.37 39.88,39.37 43.69,43.18 43.69,46.99 v44.45,47.75
  Bottom 0.406: v26.67,33.78 26.67,34.29 31.75,39.37 v35.05,39.37
CTS
  Top 0.254: IC1.8 35.53,29.75 34.39,30.63 U$2.10
D+  (via drill 0.6)
  Top 0.254: IC1.14 39.1,28.69 38.86,28.45 35.31,28.45 v35.05,28.7
  Top 0.406: v33.78,35.81 v33.78,41.15 | v32.51,42.93 32.51,44.54 R234.1
  Bottom 0.406: v35.05,28.7 33.53,28.7 33.02,28.96 33.02,34.8 v33.78,35.81 | v33.78,41.15 33.78,41.66 v32.51,42.93
D-  (via drill 0.6)
  Top 0.254: IC1.15 39.6,28.43 38.86,27.69 32.77,27.69 v32.26,28.19
  Top 0.406: v32.26,35.81 32.26,41.15 33.78,42.67 33.78,46.48 33.02,47.24 R235.1
  Bottom 0.406: v32.26,28.19 v32.26,35.81
DGND  (via drill 0.5, 0.6)
  Top 0.254: IC1.4 35.06,31.75 35.05,31.75 | 41.37,33.25 IC1.24 41.12,33.25 41.4,33.53 41.4,34.29 v40.64,35.05 40.39,34.8 39.88,34.8 39.6,34.52 IC1.26 39.6,34.56 39.37,34.8 | 41.37,33.25 41.4,33.27 | IC1.20 41.15,31.25 41.4,31.5 41.4,33.22 41.37,33.25 | 40.64,29.72 40.61,29.75 IC1.17 40.87,29.75 41.4,29.21 41.4,28.7 | IC8.20 50.51,50.76 50.29,50.55 49.02,50.55 | 49.02,50.55 49.02,51.66 IC8.23 | 44.45,40.21 IC8.49 | v48.26,38.86 IC8.57 | 46.48,41.66 46.51,41.63 IC8.53 46.51,42.14 46.23,42.42 | IC8.41 44.19,45.72 45.21,44.7 | IC8.51 45.51,41.19 45.72,41.4 | 46,42.14 45.72,42.42 | v1.52,9.91 2.54,9.91 2.03,9.4 C24.2 | U$2.29 13.32,26.64 C27.2 | IC8.25 48.01,50.55 49.02,50.55
  Top 0.406: 49.11,30.73 C17.1
  Top 0.61: C2.1 49.11,30.73
  Top 1.27: 33.78,51.31 36.32,51.31 | 33.27,55.63 37.08,55.63 | 39.37,35.05 39.37,38.1 | 50.04,16.76 50.04,19.3 | 65.28,17.02 65.28,19.56 | 68.83,17.02 68.83,19.56
  Bottom 0.254: U$1.6 3.09,9.95 v1.52,9.91
  Bottom 1.27: 37.08,55.63 33.27,55.63 | 39.37,35.05 39.37,38.1 | 50.04,16.76 50.04,19.3 | 65.28,17.02 65.28,19.56 | 68.83,17.02 68.83,19.56
  other vias: 38.86,21.59 50.29,35.31 30.73,52.58 34.8,31.5 38.61,24.64 65.28,51.56 27.18,44.7 49.53,45.97 55.37,40.39 43.18,40.13 58.42,20.57 29.21,13.97 12.45,1.52 2.03,38.86 20.83,16.51 19.81,23.11 14.99,21.59 29.21,39.12 45.21,32.26 22.1,48.01 18.8,28.7 43.43,55.88 45.97,42.42 40.64,37.59 31.24,31.5 25.15,49.02 45.72,45.21 30.99,27.69 41.66,4.57 29.46,9.14 30.99,25.65 10.41,28.19 35.81,5.59
  pour Top (isolate 0.25): 0.51,0.25 69.34,0.25 69.34,17.53 45.97,17.53 45.97,33.78 34.04,37.59 34.04,56.39 21.34,56.39 21.34,44.7 15.75,39.37 0.25,39.37
  pour Bottom (isolate 0.25): 0.25,0.25 69.34,0.25 69.34,17.53 45.97,17.53 45.97,33.78 34.04,37.59 34.04,56.39 21.34,56.39 21.34,44.7 15.75,39.37 0.25,39.37
  pour Top (isolate 0.25): 71.12,19.3 47.75,19.3 47.75,34.54 36.32,38.35 36.32,56.39 71.12,56.39
  pour Bottom (isolate 0.25): 71.12,19.3 47.75,19.3 47.75,34.54 36.32,38.35 36.32,56.39 71.12,56.39
ECG
  Top 0.254: SV3.2 57.66,32.77 58.17,33.27 58.17,39.12 55.06,42.22 IC8.1 53.28,42.22 52.58,42.93 52.58,43.18 52.62,43.22 | IC8.3 52.62,43.22 | IC8.5 52.61,44.22 | 52.61,44.22 52.58,44.2 52.58,43.27 52.62,43.22 | IC8.7 52.59,45.22 52.58,45.21 | 52.58,45.21 52.58,44.25 52.61,44.22 | IC8.9 52.58,46.22 52.58,46.23 | 52.58,46.23 52.58,45.21 | IC8.15 52.27,49.22 52.07,49.02 52.07,46.74 52.58,46.23
ECG_VREF  (via drill 0.6)
  Top 0.254: IC8.60 50.01,40.87 50.8,41.66 v52.58,41.66
  Top 0.406: SV3.1 54.48,28.07 U7.5 54.48,26.54 51.94,24 U7.2
  Top 0.61: U7.1 U7.2
  Bottom 0.254: v52.58,41.66 52.58,33.27 55.63,30.23 SV3.1
F_SEL  (via drill 0.5, 0.6)
  Top 0.254: IC8.39 42.55,46.74 36.32,46.74 34.29,48.77 v34.29,49.02
  Top 0.406: U$2.23 15.67,31.42 v15.75,31.5
  Bottom 0.254: 15.75,36.58 25.91,46.74 34.29,46.74 v34.29,49.02
  Bottom 0.406: v15.75,31.5 15.75,36.58
GPIO1  (via drill 0.6)
  Top 0.254: 14.35,28.19 U$2.27
  Top 0.406: SV2.6 23.11,9.91 19.3,9.91 15.49,13.72 15.49,19.56 v16,20.07 | v16.26,28.7 15.49,28.19 14.35,28.19
  Bottom 0.406: v16,20.07 15.24,19.3 14.22,19.3 13.21,20.32 13.21,28.19 15.49,28.19 v16.26,28.7
GPIO2  (via drill 0.6)
  Top 0.254: 17.78,21.59 U$2.36
  Top 0.406: v19.3,11.43 19.3,11.94 16.26,14.99 16.26,18.8 17.78,20.32 17.78,21.59
  Bottom 0.254: SV2.4 24.13,11.18 22.86,12.45 20.07,12.45 v19.3,11.43
LO_BATT  (via drill 0.6)
  Top 0.254: 45.18,25.65 LED1.C
  Top 0.406: U5.4 32.72,5.33 28.7,5.33 27.43,6.6 27.43,8.64 32,13.21 33.27,13.21 33.86,13.79 U3.4 35.69,14.35 v36.32,14.99 | v43.69,25.65 45.18,25.65
  Bottom 0.406: v36.32,14.99 36.32,23.88 38.1,25.65 v43.69,25.65
MCLR
  Top 0.406: JP2.2 20.66,36.92 R16.1 18.96,36.58 R19.1 17.36,37 16,37.85 4.32,37.85 SV1.6
N$1
  Top 0.406: U3.3 31.2,15.62 C5.2
N$2
  Top 0.406: U3.5 40.07,14.35 R1.2
N$3
  Top 0.254: R4.2 52.01,52.94 IC8.17 IC8.18
N$4
  Top 0.406: L1.1 41.29,18.16 U3.8 38.79,19.42 D2-ZENER.A
N$5  (via drill 0.6)
  Top 0.254: IC8.14 57.87,48.72 v59.44,50.29 | 64.01,53.43 R14.1
  Top 0.406: R14.1 LA.1 | v60.45,53.09 60.45,54.61 60.96,55.12 63.25,55.12 64.01,54.36 64.01,53.43
  Bottom 0.406: v59.44,50.29 59.44,52.07 v60.45,53.09
N$6  (via drill 0.6)
  Top 0.254: IC8.16 57.09,49.72 v57.15,49.78
  Top 0.406: R12.1 V6.1
  Bottom 0.406: v57.15,49.78 57.15,48.77 59.69,46.23 64.52,46.23 V6.1
N$7  (via drill 0.6)
  Top 0.254: v59.69,48.51 59.4,48.22 IC8.13 52.8,48.22 52.58,48.01 52.58,47.5 52.85,47.22 IC8.11
  Top 0.406: R6.2 RA.1
  Bottom 0.406: v59.69,48.51 65.79,48.51 RA.1
N$8
  Top 0.254: IC8.30 45.51,52.53 44.96,53.09 44.96,53.45 C12.2
N$9  (via drill 0.6)
  Top 0.254: IC8.12 58.45,47.72 59.18,46.99 60.2,46.99 v60.45,47.24
  Top 0.406: R13.1 66.8,47.24 LL.1
  Bottom 0.406: v60.45,47.24 66.8,47.24 LL.1
N$10
  Top 0.305: IC1.16 40.1,27.29 C1.2
N$12  (via drill 0.6)
  Top 0.254: IC8.10 58.43,46.72 v60.2,44.96 | 64.52,40.22 R11.1
  Top 0.406: R11.1 V5.1 | v64.52,41.66 64.52,40.22
  Bottom 0.254: v60.2,44.96 61.21,44.96 v64.52,41.66
N$13
  Top 0.61: D1.A POS.1
N$14  (via drill 0.6)
  Top 0.254: IC8.8 55.88,45.72 v56.89,45.72
  Top 0.406: V4.1 R10.1 63.25,36.66 v63.25,38.1
  Bottom 0.406: v63.25,38.1 63.25,39.37 v56.89,45.72
N$15
  Top 0.254: IC8.24 48.51,52.97 C13.1 C11.1
N$16  (via drill 0.6)
  Top 0.254: IC8.6 56.62,44.72 59.94,41.4 59.94,35.31 v60.45,35.05 | 63.25,33.19 R9.1
  Top 0.406: V3.1 R9.1 | v63.25,34.54 63.25,33.19
  Bottom 0.406: v60.45,35.05 61.98,35.05 v63.25,34.54
N$17  (via drill 0.6)
  Top 0.254: IC8.4 55.84,43.72 59.44,40.13 59.44,32 v60.2,31.24 | 63.25,29.63 R8.1
  Top 0.406: R8.1 V2.1 | v63.25,30.99 63.25,29.63
  Bottom 0.406: v60.2,31.24 62.48,31.24 v63.25,30.99
N$18
  Top 0.406: 53.17,22.9 U7.3
  Top 0.61: R18.1 R17.2 53.17,22.9
N$19  (via drill 0.6)
  Top 0.254: IC8.2 55.57,42.72 58.93,39.37 58.93,28.96 59.69,27.69 v60.45,27.69 | 63.25,26.07 R15.1
  Top 0.406: R15.1 V1.1 | v63.25,27.43 63.25,26.07
  Bottom 0.406: v60.45,27.69 62.23,27.69 v63.25,27.43
N$20
  Top 0.254: IC8.61 IC8.62 IC8.63 51.51,39.68 53.34,37.85 R7.1
N$21
  Top 0.254: JP2.1 C10.2
N$22
  Top 0.406: C29.2 33.73,7.62 U5.3
N$23
  Top 0.406: R16.2 19.3,33.2 U$2.18
N$24
  Top 0.406: C15.1 25.83,28.19 U$2.7
N$25  (via drill 0.6)
  Top 0.254: 56.11,12.95 U6.3
  Top 0.406: IC5.IN 66.13,14.64 C33.1 C32.1 60.36,14.64 59.69,13.97 58.17,13.97 57.15,12.95 56.11,12.95 | U6.3 55.45,12.45 C61.2 54.1,12.28 v54.1,10.92 53.09,9.91 C23.1 | 4.83,8.98 C24.1
  Top 0.61: D1.C 54.44,5.25 v54.1,5.59 | v48.26,3.05 46.74,1.52 v14.99,1.52 v14.99,9.65 | 4.83,8.98 IC4.IN | C24.1 6.44,10.92 v11.68,10.92
  Bottom 0.406: v54.1,5.59 v54.1,10.92 | IC4.IN 4.83,3.81 5.84,4.32
  Bottom 0.61: v48.26,3.05 51.56,3.05 v54.1,5.59 | v14.99,9.65 12.95,9.65 v11.68,10.92
N$26
  Top 0.406: U6.5 58.78,16.34 R81.1
N$27
  Top 0.406: U6.2 57.15,13.97 57.4,14.22 57.4,15.49 56.64,16.26 56.64,16.58 R81.2
N$28
  Top 0.406: R82.1 LED3.A
N$29
  Top 0.406: LED3.C 55.96,14.99 U6.1
N$32
  Top 0.254: IC8.28 46.51,52.55 45.97,53.09 C37.2
N$33
  Top 0.254: IC8.26 47.51,53.44 C38.2
N$38
  Top 0.406: U5.5 38.8,6.48 R29.2
N$40
  Top 0.406: L2.1 38.91,10.41 U5.8 38.79,11.82 D4-ZENER.A
N$41
  Top 0.61: R31.1 LED1.A
N$42
  Top 0.406: LED2.A R32.1
N$44
  Top 0.254: IC8.64 52.18,40.27 53.34,39.12 53.99,39.12 C44.2
  Top 0.406: C44.2 54.1,37.85 SV3.3
N$45
  Top 0.406: LED4.A R34.1
N$46
  Top 0.254: IC8.55 47.51,39.52 C45.1
N$102  (via drill 0.6)
  Top 0.406: U4.6 16.89,48.39 v15.75,48.77
  Bottom 0.406: v15.75,48.77 R216.1
N$103  (via drill 0.6)
  Top 0.406: U4.7 16.89,47.12 v15.75,46.99
  Bottom 0.406: R215.1 v15.75,46.99
N$123  (via drill 0.6)
  Top 0.406: v11.68,48.77 11.18,49.02 9.44,49.02 CN1.D-
  Bottom 0.406: R216.2 11.94,49.28 v11.68,48.77
N$124
  Top 0.406: U4.10 28.23,47.12 R234.2
N$140  (via drill 0.6)
  Top 0.406: CN1.D+ 10.67,48.26 v11.43,47.5
  Bottom 0.406: R215.2 11.94,46.99 v11.43,47.5
N$141
  Top 0.406: R235.2 29.97,47.24 28.83,48.39 U4.11
PGEC
  Top 0.406: SV1.2 4.57,26.16 10.92,32.51 15.42,32.51 U$2.22
PGED
  Top 0.406: U$2.21 16.87,34.44 16.76,34.54 14.22,34.54 13.97,34.29 12.45,34.29 12.19,34.54 11.18,34.54 10.03,33.4 9.91,33.27 5.33,28.7 SV1.3
READY  (via drill 0.6)
  Top 0.254: IC8.47 45.01,42.72 46.99,44.7 46.99,48.26 v45.97,49.28
  Top 0.406: U$2.20 17.68,34.65 17.02,35.31 v13.21,35.31
  Bottom 0.254: v13.21,35.31 13.21,35.56 28.45,50.8 44.45,50.8 v45.97,49.28
RESET_WIFI  (via drill 0.6)
  Top 0.254: 14.43,24.13 U$2.32
  Top 0.406: SV2.5 19.56,8.64 14.73,13.46 v14.73,20.32 | v15.75,23.62 15.75,24.13 14.43,24.13
  Bottom 0.406: v14.73,20.32 14.48,20.32 13.97,20.83 13.97,22.35 v15.75,23.62
RLD  (via drill 0.6)
  Top 0.254: 52.07,27.74 U7.7
  Top 0.406: U7.7 51.94,30.01 R88.1 C52.1 | RL.1 58.67,22.61 v56.39,24.89 | v52.07,25.65 52.07,27.74
  Bottom 0.406: v56.39,24.89 52.83,24.89 v52.07,25.65
RLD_DR
  Top 0.254: 53.34,32.6 C52.2
  Top 0.406: U7.6 53.21,30.01 R88.2 C52.2 | R7.2 53.34,32.6
RTS
  Top 0.254: IC1.32 35.29,33.8 35.05,34.04 33.78,34.04 33.53,33.78 28.18,33.8 U$2.11
RX_USB  (via drill 0.6)
  Top 0.254: IC1.2 35.29,32.75 35.05,32.51 33.27,32.51 33.02,32.77 28.47,32.75 v28.45,32.77 | 22.45,31.6 v22.35,31.5
  Top 0.406: U$2.14 22.45,31.6
  Bottom 0.406: v28.45,32.77 23.62,32.77 22.73,31.88 v22.35,31.5
RX_WIFI  (via drill 0.6)
  Top 0.254: 25.91,25.15 U$2.3
  Top 0.406: SV2.8 25.4,6.1 26.42,7.11 v26.42,18.29 | v28.45,25.15 25.91,25.15
  Bottom 0.406: v26.42,18.29 26.42,23.11 v28.45,25.15
SD_SEL  (via drill 0.6)
  Top 0.254: 14.22,30.73 U$2.24
  Top 0.406: v6.35,22.86 6.35,26.42 10.67,30.73 14.22,30.73
  Bottom 0.406: U$1.2 6.48,14.35 6.86,14.73 6.86,22.35 v6.35,22.86
SHDN_AN  (via drill 0.6)
  Top 0.254: 25.91,24.13 U$2.2
  Top 0.406: U5.1 31.62,10.29 v31.5,10.41 | v29.46,24.13 25.91,24.13
  Bottom 0.406: v31.5,10.41 31.5,22.1 v29.46,24.13
SPI_CLK_1  (via drill 0.6)
  Top 0.254: U$2.26 15.06,29.03 | v41.15,45.47 41.15,46.23 IC8.40
  Top 0.406: 15.06,29.03 16.51,29.97 v19.81,29.97 | v25.4,40.13 25.4,41.66 v27.69,43.18 | v35.05,44.7 38.35,44.7 v38.61,44.45
  Bottom 0.406: v19.81,29.97 20.32,30.48 20.32,39.37 20.83,39.88 25.15,39.88 v25.4,40.13 | v27.69,43.18 31.24,43.18 32.77,44.7 v35.05,44.7 | v38.61,44.45 40.13,44.45 v41.15,45.47
SPI_CLK_2  (via drill 0.6)
  Top 0.254: 22.61,21.54 U$2.42 22.61,21.84
  Top 0.406: v18.54,18.03 18.54,17.02 19.56,15.49 21.59,15.49 v22.61,17.53 | v22.61,23.37 22.61,21.84
  Bottom 0.406: U$1.5 6.73,11.05 10.16,14.48 10.16,16.76 11.18,17.78 17.78,17.78 18.03,18.03 v18.54,18.03 | v22.61,17.53 v22.61,23.37
SPI_IN_1  (via drill 0.6)
  Top 0.254: 37.31,26.64 v37.34,26.67 | 44.45,49.28 43.69,49.28 43.64,49.22 IC8.34
  Top 0.406: U$2.5 37.31,26.64 | v43.94,49.28 44.45,49.28
  Bottom 0.254: 44.45,49.28 v43.94,49.28
  Bottom 0.406: v37.34,26.67 40.89,26.67 43.43,29.21 43.43,38.86 44.45,39.88 44.45,46.48 45.47,47.5 45.47,48.26 44.45,49.28
SPI_IN_2  (via drill 0.6)
  Top 0.254: 14.22,23.34 U$2.33
  Top 0.406: v8.13,20.32 12.19,20.32 14.22,22.35 14.22,23.34
  Bottom 0.406: U$1.3 6.65,13.25 8.13,14.73 v8.13,20.32
SPI_OUT_1  (via drill 0.6)
  Top 0.254: U$2.25 14.83,29.82 | v41.15,43.43 41.15,43.94 41.93,44.72 IC8.43
  Top 0.406: 14.83,29.82 16.76,30.73 18.03,30.73 18.29,30.99 v19.05,30.99 | v35.05,40.64 36.58,40.64 v38.86,42.93
  Bottom 0.254: v19.05,30.99 19.3,31.24
  Bottom 0.406: 19.3,31.24 19.3,39.37 20.83,40.89 24.64,40.89 25.15,41.4 32,41.4 33.27,40.13 34.54,40.13 v35.05,40.64 | v38.86,42.93 40.64,42.93 v41.15,43.43
SPI_OUT_2  (via drill 0.6)
  Top 0.254: 21.59,21.77 U$2.41
  Top 0.406: v21.59,24.13 21.59,21.77
  Bottom 0.254: U$1.7 5.8,8.85
  Bottom 0.406: 5.8,8.85 10.92,13.97 10.92,16 11.94,17.02 19.81,17.02 21.59,18.8 v21.59,24.13
START  (via drill 0.5, 0.6)
  Top 0.254: 18.54,33.1 U$2.19 | IC8.38 36.6,47.22 35.56,48.26 35.56,49.53 v35.05,50.04
  Top 0.406: v17.53,31.75 18.29,31.75 18.54,32 18.54,33.1
  Bottom 0.254: v17.53,31.75 17.53,30.73 17.27,30.48 15.24,30.48 14.48,31.24 14.48,36.07 28.45,50.04 v35.05,50.04
TX_USB  (via drill 0.6)
  Top 0.254: IC1.30 37.6,34.53 37.34,34.8 v25.4,34.8 | U$2.15 21.67,34.87 v21.84,35.05
  Bottom 0.254: v25.4,34.8 22.1,34.8 v21.84,35.05
TX_WIFI  (via drill 0.6)
  Top 0.254: 25.73,25.91 U$2.4
  Top 0.406: SV2.1 22.35,13.72 v24.13,18.29 | v24.38,25.91 25.73,25.91
  Bottom 0.406: v24.13,18.29 24.13,25.65 v24.38,25.91
USB_GND
  Top 0.406: 17.87,45.89 U4.8
  pour Bottom (isolate 0.5): 0.25,40.89 15.49,40.89 19.81,45.21 19.81,56.39 0.25,56.39
  pour Top (isolate 0.5): 0.25,40.89 15.49,40.89 19.81,45.21 19.81,56.39 0.25,56.39
VBUS  (via drill 0.6)
  Top 0.254: v59.94,11.68 59.94,11.86 | 48.58,18.22 v48.51,18.29 | U4.4 22.23,50.93 v22.35,51.05
  Top 0.406: 15.75,50.93 U4.4 U4.3 | U4.1 16.89,54.74 15.75,53.59 15.75,50.93 | C60.2 57.4,11.66 U6.4 59.94,11.86 | v49.02,12.7 48.58,13.14 R82.2 48.58,18.22 | CN1.VBUS 12.71,49.86 C18.2 13.97,50.8 14.1,50.93 15.75,50.93
  Bottom 0.254: v48.51,18.29 48.01,18.29 46.99,19.3 46.99,49.78 45.47,51.31 22.86,51.31 v22.35,51.05
  Bottom 0.406: v49.02,12.7 58.93,12.7 v59.94,11.68
VCC  (via drill 0.6)
  Top 0.254: IC8.22 IC8.21 50.04,51.7 50.04,52.32 50.29,52.58 50.8,52.58 51.01,52.37 IC8.19 v51.01,50.08 | v51.01,50.08 51.05,50.04 | v51.01,50.08 51.52,50.08 51.56,50.04 | IC8.56 48.01,41.14 47.75,41.4 | 47.75,41.4 46.99,41.4 46.99,40.29 IC8.54 | 47.75,41.4 49.28,41.4 v49.53,41.66 49.51,41.64 IC8.59 49.51,38.26 C53.2 | C53.2 C48.2 | C53.2 48.91,38.24 48.51,37.85 48.51,33.02 v48.01,32.51 | v48.51,27.43 48.51,27.6 C17.2
  Top 0.406: C31.2 41.44,7.75 U5.6 37.97,7.75 36.7,9.02 | U5.2 36.7,9.02 | 36.7,9.02 36.83,9.14 36.83,11.47 D4-ZENER.C 35.31,11.94 v35.05,12.19 | C17.2 49.92,28.61 U7.8 | R14.2 62.4,53 60.71,51.31 | 60.71,51.31 60.71,48.26 61.72,47.24 R13.2 61.63,47.24 R12.2 R11.2 R10.2 R9.2 R8.2 R15.2 | 51.05,50.04 51.56,50.04 52.07,50.04 53.59,51.56 60.45,51.56 60.71,51.31 | v22.35,27.43 22.35,29.46 20.07,30.99 U$2.17
  Top 0.61: U7.8 50.67,25.78 49.53,24.64 49.53,21.59 | 49.53,21.59 50.55,20.57 R17.1 | C31.2 41.57,6.69 42.42,5.84 44.45,5.84 v45.97,7.37 | v46.99,12.19 46.99,19.05 49.53,21.59
  Bottom 0.254: v51.01,50.08 50.09,49.16 C39.2 48.26,47.89 48.26,42.67 48.66,42.28 C40.2 v49.53,41.66 | v48.01,32.51 48.01,27.94 v48.51,27.43
  Bottom 0.406: v35.05,12.19 35.05,20.07 28.19,26.92 22.86,26.92 v22.35,27.43
  Bottom 0.61: v45.97,7.37 45.97,11.18 v46.99,12.19
VIN  (via drill 0.6)
  Top 0.254: C6.2 42.86,22.25 R3.2 43.05,20.13 | L2.2 43.42,10.91 | 13.65,6.79 v13.72,6.86
  Top 0.406: C30.2 13.11,14.39 R30.2 13.14,14.22 R32.2
  Top 0.61: IC4.OUT 9.91,3.56 13.14,6.79 | R3.2 43.42,19.76 L1.2 44.7,18.29 45.21,17.78 v45.21,12.7 43.42,10.91 | R31.2 43.05,20.13 | 13.14,6.79 13.65,6.79 | R32.2 13.14,6.79
  Bottom 0.61: v13.72,6.86 16.51,4.06 36.58,4.06 v45.21,12.7
VIN_WIFI
  Top 0.406: 60.87,8.64 C35.1 | 44.2,3.3 24.64,3.3 SV2.7
  Top 0.61: C35.1 C34.1 65.62,8.72 IC5.OUT | 60.87,8.64 59.69,8.64 58.35,7.3 R34.2 48.19,7.3 44.2,3.3
XTAL_IN
  Top 0.406: 12.1,26.16 C27.1 | U$2.30 12.43,25.83 C27.1 | R28.2 9.81,25.74 X1.P$2 12.17,26.09 C27.1
XTAL_OUT
  Top 0.406: U$2.31 13.36,25.04 12.95,24.64 12.61,24.64 C28.1 11.67,23.69 X1.P$1 9.81,24.04 R28.1

### Text on the board
Top: LA | RA | LL | V6 | V5 | V4 | V3 | V2 | V1 | RLD | ECG | + | -